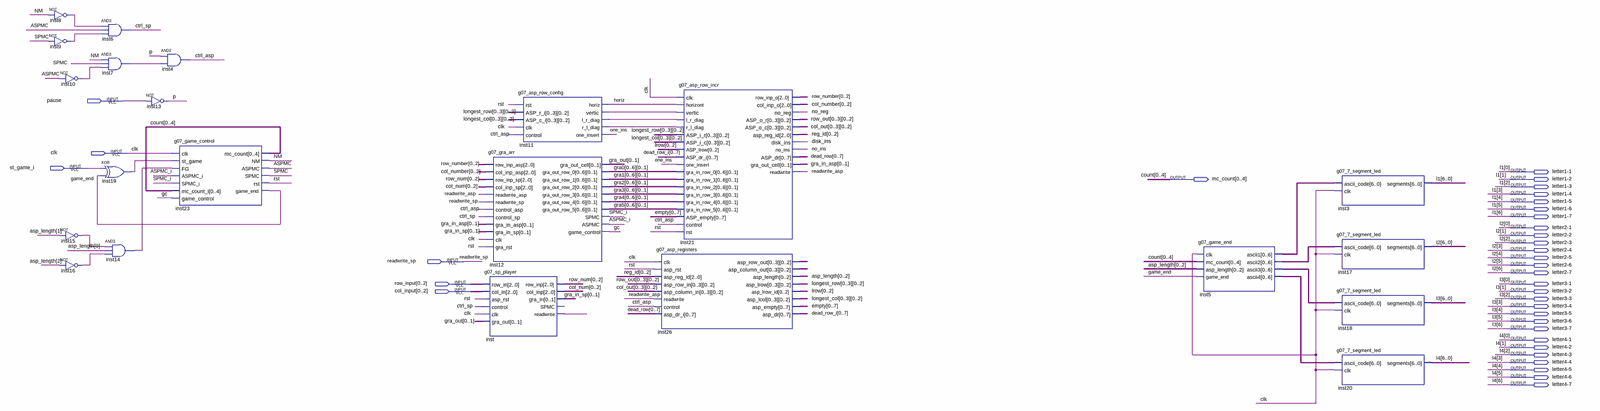
[diagram p0: schematic sheet, whole]
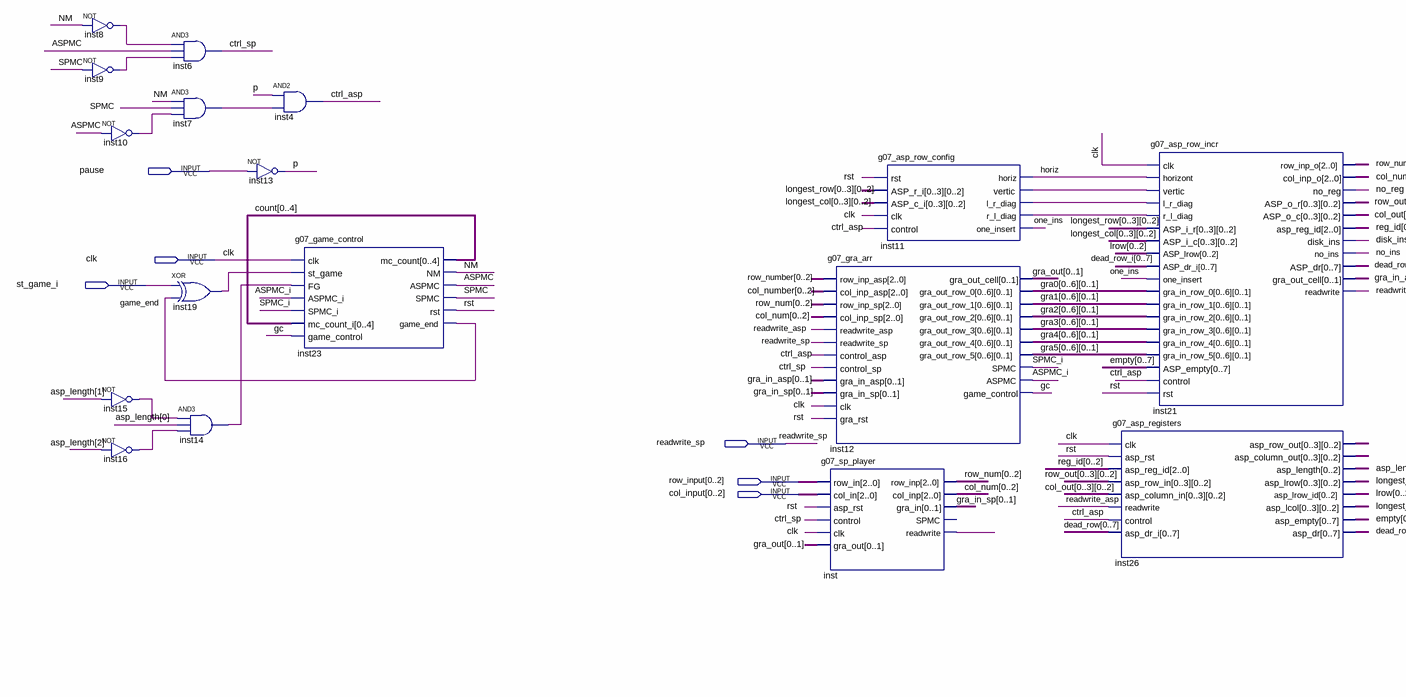
[diagram p1: schematic sheet, left part]
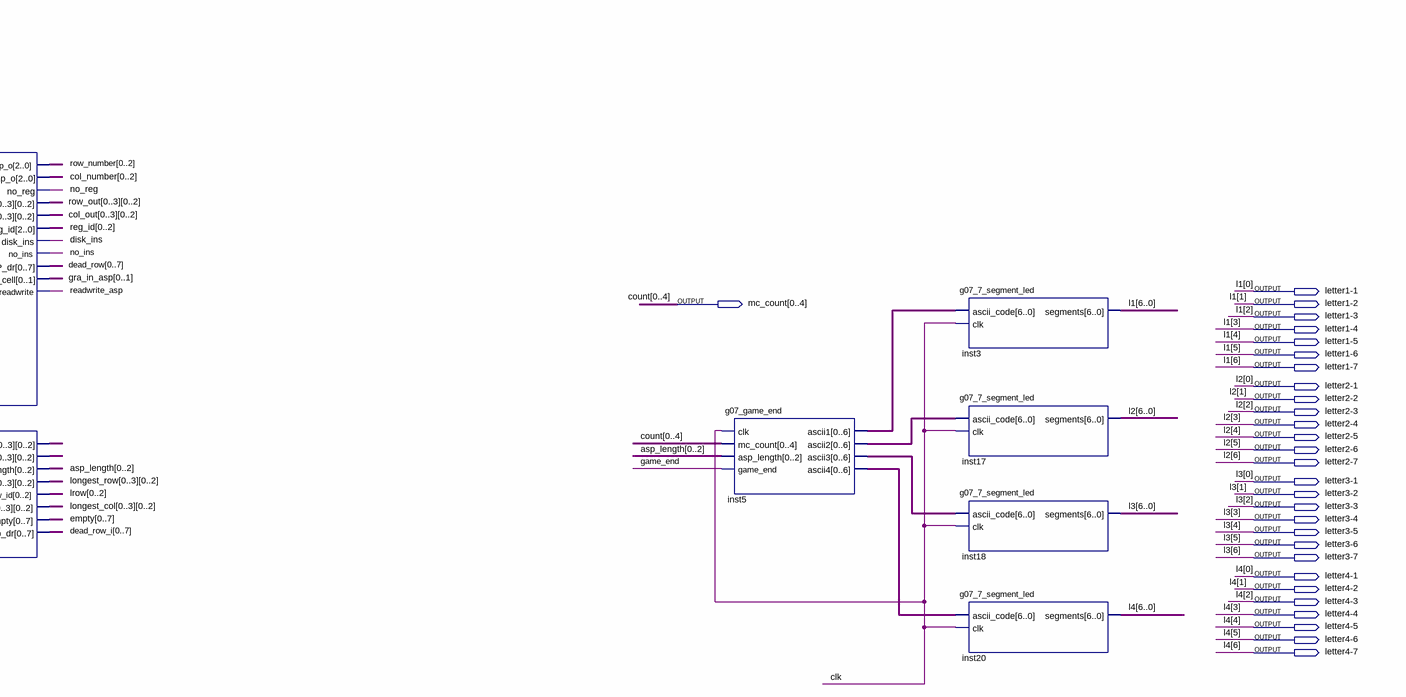
[diagram p2: schematic sheet, right part]
// Quartus schematic g07_complete_game2.bdf as structural Verilog: 22 symbols, 35 pins
module g07_complete_game2 (
  input  pause,
  input  clk,
  input  st_game_i,
  input  readwrite_sp,
  input  [0:2] row_input,
  input  [0:2] col_input,
  output \letter1-1 ,
  output [0:4] mc_count,
  output \letter1-2 ,
  output \letter1-3 ,
  output \letter1-4 ,
  output \letter1-5 ,
  output \letter1-6 ,
  output \letter1-7 ,
  output \letter2-1 ,
  output \letter2-2 ,
  output \letter2-3 ,
  output \letter2-4 ,
  output \letter2-5 ,
  output \letter2-6 ,
  output \letter2-7 ,
  output \letter3-1 ,
  output \letter3-2 ,
  output \letter3-3 ,
  output \letter3-4 ,
  output \letter3-5 ,
  output \letter3-6 ,
  output \letter3-7 ,
  output \letter4-1 ,
  output \letter4-2 ,
  output \letter4-3 ,
  output \letter4-4 ,
  output \letter4-5 ,
  output \letter4-6 ,
  output \letter4-7 
);

  wire ASPMC, ASPMC_i, ctrl_asp, ctrl_sp, disk_ins, game_end, gc, horiz, inst7_out, inst8_out, inst9_out,
       inst10_out, inst11_l_r_diag, inst11_r_l_diag, inst11_vertic, inst14_out, inst15_out, inst16_out,
       inst19_out, inst_readwrite, NM, no_ins, no_reg, one_ins, p, readwrite_asp, rst, SPMC, SPMC_i;
  wire [1:0] gra0_0, gra0_1, gra0_2, gra0_3, gra0_4, gra0_5, gra0_6, gra1_0, gra1_1, gra1_2, gra1_3, gra1_4,
       gra1_5, gra1_6, gra2_0, gra2_1, gra2_2, gra2_3, gra2_4, gra2_5, gra2_6, gra3_0, gra3_1, gra3_2,
       gra3_3, gra3_4, gra3_5, gra3_6, gra4_0, gra4_1, gra4_2, gra4_3, gra4_4, gra4_5, gra4_6, gra5_0,
       gra5_1, gra5_2, gra5_3, gra5_4, gra5_5, gra5_6, gra_in_asp, gra_in_sp, gra_out;
  wire [2:0] asp_length, col_num, col_number, col_out_0, col_out_1, col_out_2, col_out_3, longest_col_0,
       longest_col_1, longest_col_2, longest_col_3, longest_row_0, longest_row_1, longest_row_2,
       longest_row_3, lrow, reg_id, row_num, row_number, row_out_0, row_out_1, row_out_2, row_out_3;
  wire [6:0] inst5_ascii1, inst5_ascii2, inst5_ascii3, inst5_ascii4;
  wire [7:0] dead_row, dead_row_i, empty;
  wire [11:0] inst26_asp_column_out, inst26_asp_row_out;

  not inst8 (inst8_out, NM);
  not inst9 (inst9_out, SPMC);
  not inst10 (inst10_out, ASPMC);
  not inst15 (inst15_out, asp_length[1]);
  not inst16 (inst16_out, asp_length[2]);
  and inst6 (ctrl_sp, inst8_out, ASPMC, inst9_out);
  and inst7 (inst7_out, NM, SPMC, inst10_out);
  xor inst19 (inst19_out, st_game_i, game_end);
  and inst14 (inst14_out, inst15_out, asp_length[0], inst16_out);
  and inst4 (ctrl_asp, p, inst7_out);
  not inst13 (p, pause);
  g07_game_control inst23 (
    .clk(clk), .st_game(inst19_out), .FG(inst14_out), .ASPMC_i(ASPMC_i), .SPMC_i(SPMC_i),
    .mc_count_i(mc_count), .game_control(gc), .mc_count(mc_count), .NM(NM), .ASPMC(ASPMC), .SPMC(SPMC),
    .rst(rst), .game_end(game_end));
  g07_gra_arr inst12 (
    .row_inp_asp({row_number[0], row_number[1], row_number[2]}),
    .col_inp_asp({col_number[0], col_number[1], col_number[2]}),
    .row_inp_sp({row_num[0], row_num[1], row_num[2]}), .col_inp_sp({col_num[0], col_num[1], col_num[2]}),
    .readwrite_asp(readwrite_asp), .readwrite_sp(readwrite_sp), .control_asp(ctrl_asp), .control_sp(ctrl_sp),
    .gra_in_asp({gra_in_asp[0], gra_in_asp[1]}), .gra_in_sp({gra_in_sp[0], gra_in_sp[1]}), .clk(clk),
    .gra_rst(rst), .gra_out_cell({gra_out[0], gra_out[1]}),
    .gra_out_row_0({gra0_0[0], gra0_0[1], gra0_1[0], gra0_1[1], gra0_2[0], gra0_2[1], gra0_3[0], gra0_3[1], gra0_4[0], gra0_4[1], gra0_5[0], gra0_5[1], gra0_6[0], gra0_6[1]}),
    .gra_out_row_1({gra1_0[0], gra1_0[1], gra1_1[0], gra1_1[1], gra1_2[0], gra1_2[1], gra1_3[0], gra1_3[1], gra1_4[0], gra1_4[1], gra1_5[0], gra1_5[1], gra1_6[0], gra1_6[1]}),
    .gra_out_row_2({gra2_0[0], gra2_0[1], gra2_1[0], gra2_1[1], gra2_2[0], gra2_2[1], gra2_3[0], gra2_3[1], gra2_4[0], gra2_4[1], gra2_5[0], gra2_5[1], gra2_6[0], gra2_6[1]}),
    .gra_out_row_3({gra3_0[0], gra3_0[1], gra3_1[0], gra3_1[1], gra3_2[0], gra3_2[1], gra3_3[0], gra3_3[1], gra3_4[0], gra3_4[1], gra3_5[0], gra3_5[1], gra3_6[0], gra3_6[1]}),
    .gra_out_row_4({gra4_0[0], gra4_0[1], gra4_1[0], gra4_1[1], gra4_2[0], gra4_2[1], gra4_3[0], gra4_3[1], gra4_4[0], gra4_4[1], gra4_5[0], gra4_5[1], gra4_6[0], gra4_6[1]}),
    .gra_out_row_5({gra5_0[0], gra5_0[1], gra5_1[0], gra5_1[1], gra5_2[0], gra5_2[1], gra5_3[0], gra5_3[1], gra5_4[0], gra5_4[1], gra5_5[0], gra5_5[1], gra5_6[0], gra5_6[1]}),
    .SPMC(SPMC_i), .ASPMC(ASPMC_i), .game_control(gc));
  g07_sp_player inst (
    .row_in(row_input), .col_in(col_input), .asp_rst(rst), .control(ctrl_sp), .clk(clk),
    .gra_out({gra_out[0], gra_out[1]}), .row_inp({row_num[0], row_num[1], row_num[2]}),
    .col_inp({col_num[0], col_num[1], col_num[2]}), .gra_in({gra_in_sp[0], gra_in_sp[1]}),
    .readwrite(inst_readwrite));  // open: SPMC
  g07_asp_row_config inst11 (
    .rst(rst),
    .ASP_r_i({longest_row_0[0], longest_row_0[1], longest_row_0[2], longest_row_1[0], longest_row_1[1], longest_row_1[2], longest_row_2[0], longest_row_2[1], longest_row_2[2], longest_row_3[0], longest_row_3[1], longest_row_3[2]}),
    .ASP_c_i({longest_col_0[0], longest_col_0[1], longest_col_0[2], longest_col_1[0], longest_col_1[1], longest_col_1[2], longest_col_2[0], longest_col_2[1], longest_col_2[2], longest_col_3[0], longest_col_3[1], longest_col_3[2]}),
    .clk(clk), .control(ctrl_asp), .horiz(horiz), .vertic(inst11_vertic), .l_r_diag(inst11_l_r_diag),
    .r_l_diag(inst11_r_l_diag), .one_insert(one_ins));
  g07_asp_row_incr inst21 (
    .clk(clk), .horizont(horiz), .vertic(inst11_vertic), .l_r_diag(inst11_l_r_diag),
    .r_l_diag(inst11_r_l_diag),
    .ASP_i_r({longest_row_0[0], longest_row_0[1], longest_row_0[2], longest_row_1[0], longest_row_1[1], longest_row_1[2], longest_row_2[0], longest_row_2[1], longest_row_2[2], longest_row_3[0], longest_row_3[1], longest_row_3[2]}),
    .ASP_i_c({longest_col_0[0], longest_col_0[1], longest_col_0[2], longest_col_1[0], longest_col_1[1], longest_col_1[2], longest_col_2[0], longest_col_2[1], longest_col_2[2], longest_col_3[0], longest_col_3[1], longest_col_3[2]}),
    .ASP_lrow({lrow[0], lrow[1], lrow[2]}),
    .ASP_dr_i({dead_row_i[0], dead_row_i[1], dead_row_i[2], dead_row_i[3], dead_row_i[4], dead_row_i[5], dead_row_i[6], dead_row_i[7]}),
    .one_insert(one_ins),
    .gra_in_row_0({gra0_0[0], gra0_0[1], gra0_1[0], gra0_1[1], gra0_2[0], gra0_2[1], gra0_3[0], gra0_3[1], gra0_4[0], gra0_4[1], gra0_5[0], gra0_5[1], gra0_6[0], gra0_6[1]}),
    .gra_in_row_1({gra1_0[0], gra1_0[1], gra1_1[0], gra1_1[1], gra1_2[0], gra1_2[1], gra1_3[0], gra1_3[1], gra1_4[0], gra1_4[1], gra1_5[0], gra1_5[1], gra1_6[0], gra1_6[1]}),
    .gra_in_row_2({gra2_0[0], gra2_0[1], gra2_1[0], gra2_1[1], gra2_2[0], gra2_2[1], gra2_3[0], gra2_3[1], gra2_4[0], gra2_4[1], gra2_5[0], gra2_5[1], gra2_6[0], gra2_6[1]}),
    .gra_in_row_3({gra3_0[0], gra3_0[1], gra3_1[0], gra3_1[1], gra3_2[0], gra3_2[1], gra3_3[0], gra3_3[1], gra3_4[0], gra3_4[1], gra3_5[0], gra3_5[1], gra3_6[0], gra3_6[1]}),
    .gra_in_row_4({gra4_0[0], gra4_0[1], gra4_1[0], gra4_1[1], gra4_2[0], gra4_2[1], gra4_3[0], gra4_3[1], gra4_4[0], gra4_4[1], gra4_5[0], gra4_5[1], gra4_6[0], gra4_6[1]}),
    .gra_in_row_5({gra5_0[0], gra5_0[1], gra5_1[0], gra5_1[1], gra5_2[0], gra5_2[1], gra5_3[0], gra5_3[1], gra5_4[0], gra5_4[1], gra5_5[0], gra5_5[1], gra5_6[0], gra5_6[1]}),
    .ASP_empty({empty[0], empty[1], empty[2], empty[3], empty[4], empty[5], empty[6], empty[7]}),
    .control(ctrl_asp), .rst(rst), .row_inp_o({row_number[0], row_number[1], row_number[2]}),
    .col_inp_o({col_number[0], col_number[1], col_number[2]}), .no_reg(no_reg),
    .ASP_o_r({row_out_0[0], row_out_0[1], row_out_0[2], row_out_1[0], row_out_1[1], row_out_1[2], row_out_2[0], row_out_2[1], row_out_2[2], row_out_3[0], row_out_3[1], row_out_3[2]}),
    .ASP_o_c({col_out_0[0], col_out_0[1], col_out_0[2], col_out_1[0], col_out_1[1], col_out_1[2], col_out_2[0], col_out_2[1], col_out_2[2], col_out_3[0], col_out_3[1], col_out_3[2]}),
    .asp_reg_id({reg_id[0], reg_id[1], reg_id[2]}), .disk_ins(disk_ins), .no_ins(no_ins),
    .ASP_dr({dead_row[0], dead_row[1], dead_row[2], dead_row[3], dead_row[4], dead_row[5], dead_row[6], dead_row[7]}),
    .gra_out_cell({gra_in_asp[0], gra_in_asp[1]}), .readwrite(readwrite_asp));
  g07_asp_registers inst26 (
    .clk(clk), .asp_rst(rst), .asp_reg_id({reg_id[0], reg_id[1], reg_id[2]}),
    .asp_row_in({row_out_0[0], row_out_0[1], row_out_0[2], row_out_1[0], row_out_1[1], row_out_1[2], row_out_2[0], row_out_2[1], row_out_2[2], row_out_3[0], row_out_3[1], row_out_3[2]}),
    .asp_column_in({col_out_0[0], col_out_0[1], col_out_0[2], col_out_1[0], col_out_1[1], col_out_1[2], col_out_2[0], col_out_2[1], col_out_2[2], col_out_3[0], col_out_3[1], col_out_3[2]}),
    .readwrite(readwrite_asp), .control(ctrl_asp),
    .asp_dr_i({dead_row[0], dead_row[1], dead_row[2], dead_row[3], dead_row[4], dead_row[5], dead_row[6], dead_row[7]}),
    .asp_row_out(inst26_asp_row_out), .asp_column_out(inst26_asp_column_out),
    .asp_length({asp_length[0], asp_length[1], asp_length[2]}),
    .asp_lrow({longest_row_0[0], longest_row_0[1], longest_row_0[2], longest_row_1[0], longest_row_1[1], longest_row_1[2], longest_row_2[0], longest_row_2[1], longest_row_2[2], longest_row_3[0], longest_row_3[1], longest_row_3[2]}),
    .asp_lrow_id({lrow[0], lrow[1], lrow[2]}),
    .asp_lcol({longest_col_0[0], longest_col_0[1], longest_col_0[2], longest_col_1[0], longest_col_1[1], longest_col_1[2], longest_col_2[0], longest_col_2[1], longest_col_2[2], longest_col_3[0], longest_col_3[1], longest_col_3[2]}),
    .asp_empty({empty[0], empty[1], empty[2], empty[3], empty[4], empty[5], empty[6], empty[7]}),
    .asp_dr({dead_row_i[0], dead_row_i[1], dead_row_i[2], dead_row_i[3], dead_row_i[4], dead_row_i[5], dead_row_i[6], dead_row_i[7]}));
  g07_game_end inst5 (
    .clk(clk), .mc_count(mc_count), .asp_length({asp_length[0], asp_length[1], asp_length[2]}),
    .game_end(game_end), .ascii1(inst5_ascii1), .ascii2(inst5_ascii2), .ascii3(inst5_ascii3),
    .ascii4(inst5_ascii4));
  g07_7_segment_led inst3 (
    .ascii_code(inst5_ascii1), .clk(clk),
    .segments({\letter1-7 , \letter1-6 , \letter1-5 , \letter1-4 , \letter1-3 , \letter1-2 , \letter1-1 }));
  g07_7_segment_led inst17 (
    .ascii_code(inst5_ascii2), .clk(clk),
    .segments({\letter2-7 , \letter2-6 , \letter2-5 , \letter2-4 , \letter2-3 , \letter2-2 , \letter2-1 }));
  g07_7_segment_led inst18 (
    .ascii_code(inst5_ascii3), .clk(clk),
    .segments({\letter3-7 , \letter3-6 , \letter3-5 , \letter3-4 , \letter3-3 , \letter3-2 , \letter3-1 }));
  g07_7_segment_led inst20 (
    .ascii_code(inst5_ascii4), .clk(clk),
    .segments({\letter4-7 , \letter4-6 , \letter4-5 , \letter4-4 , \letter4-3 , \letter4-2 , \letter4-1 }));

  // Other names for the same wires on the sheet: count[4:0] = {mc_count[4], mc_count[3], mc_count[2], mc_count[1], mc_count[0]};
  //   l1[6:0] = {\letter1-7 , \letter1-6 , \letter1-5 , \letter1-4 , \letter1-3 , \letter1-2 , \letter1-1 };
  //   l2[6:0] = {\letter2-7 , \letter2-6 , \letter2-5 , \letter2-4 , \letter2-3 , \letter2-2 , \letter2-1 };
  //   l3[6:0] = {\letter3-7 , \letter3-6 , \letter3-5 , \letter3-4 , \letter3-3 , \letter3-2 , \letter3-1 };
  //   l4[6:0] = {\letter4-7 , \letter4-6 , \letter4-5 , \letter4-4 , \letter4-3 , \letter4-2 , \letter4-1 }
endmodule
